# EAGLE design Adafruit AHT20 Temperature & Humidity (EAGLE 9.6.1)
COMPANY: ADAFRUIT INDUSTRIES; DRAWN: KTOWN; REV: A
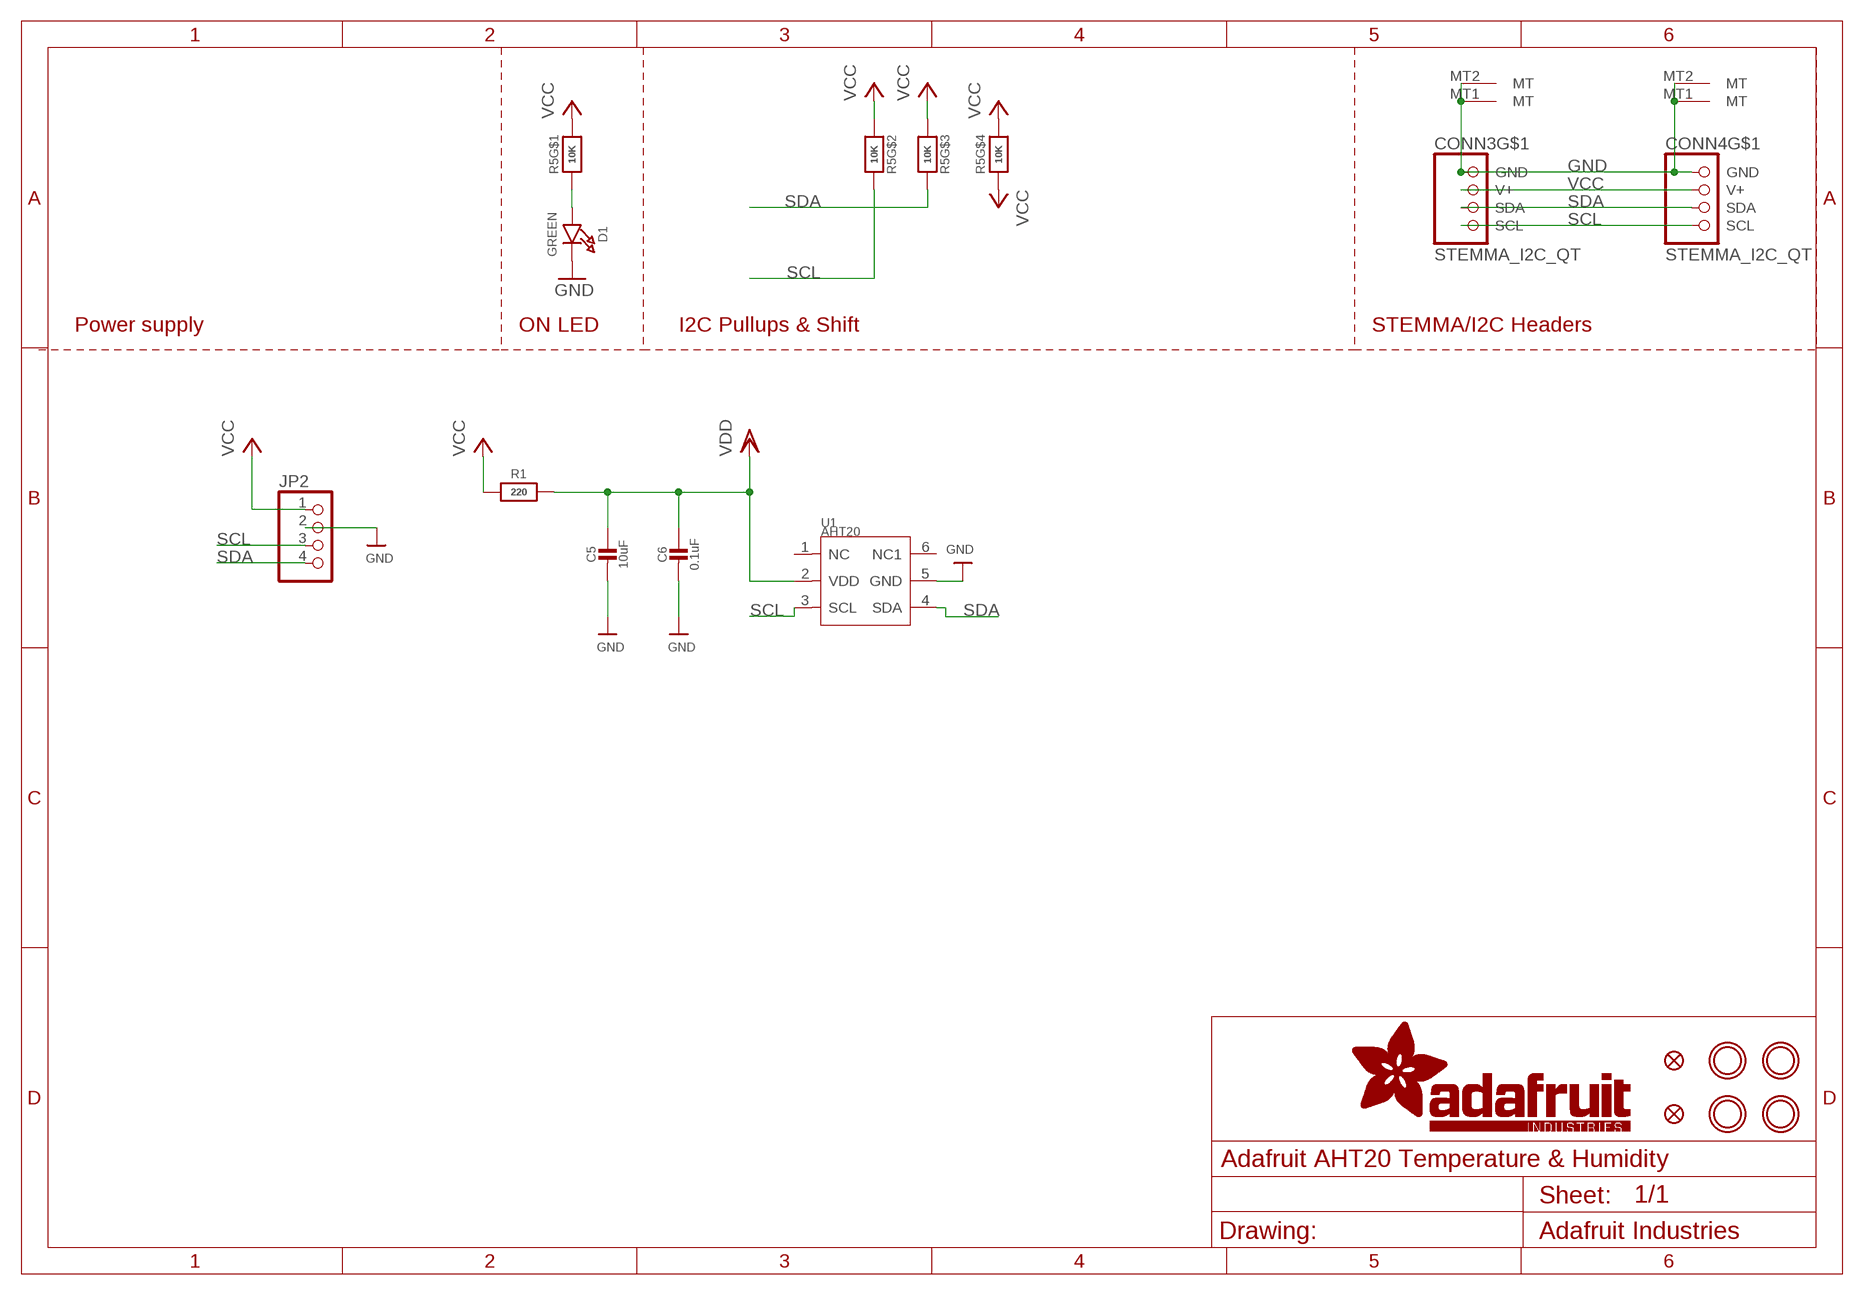
[diagram p0: schematic, sheet 1]

## Parts
C5  10uF  CAP_CERAMIC0805-NOOUTLINE  [0805-NO]
C6  0.1uF  CAP_CERAMIC0603_NO  [0603-NO]
CONN3  STEMMA_I2C_QT  [JST_SH4]
CONN4  STEMMA_I2C_QT  [JST_SH4]
D1  GREEN  LED0603_NOOUTLINE  [CHIPLED_0603_NOOUTLINE]
FID3  FIDUCIAL_1MM  [FIDUCIAL_1MM]
FID4  FIDUCIAL_1MM  [FIDUCIAL_1MM]
JP2  HEADER-1X476MIL  [1X04_ROUND_76]
R1  220  RESISTOR_0603_NOOUT  [0603-NO]
R5  10K  RESISTOR_4PACK  [RESPACK_4X0603]
U1  AHT20  SENSOR-AHT20  [SNR6-1.0-3X3X1MM]
U$19  MOUNTINGHOLE2.5  [MOUNTINGHOLE_2.5_PLATED]
U$20  MOUNTINGHOLE2.5  [MOUNTINGHOLE_2.5_PLATED]
U$22  MOUNTINGHOLE2.5  [MOUNTINGHOLE_2.5_PLATED]
U$25  MOUNTINGHOLE2.5  [MOUNTINGHOLE_2.5_PLATED]

## Nets
GND: C5.2 C6.2 CONN3.1(GND) CONN3.MT1(MT) CONN3.MT2(MT) CONN4.1(GND) CONN4.MT1(MT) CONN4.MT2(MT) D1.C JP2.2 U1.5(GND)
N$1: D1.A R5.1
SCL: CONN3.4(SCL) CONN4.4(SCL) JP2.3 R5.7 U1.3(SCL)
SDA: CONN3.3(SDA) CONN4.3(SDA) JP2.4 R5.6 U1.4(SDA)
VCC [highpower]: CONN3.2(V+) CONN4.2(V+) JP2.1 R1.1 R5.2 R5.3 R5.4 R5.5 R5.8
VDD: C5.1 C6.1 R1.2 U1.2(VDD)
Unconnected: U1.1(NC) U1.6(NC1)

## Notes on the sheet
- Power supply | ON LED | I2C Pullups & Shift | STEMMA/I2C Headers

## Library data of the parts
C5 C6 = microbuilder:CAP_CERAMIC: Ceramic Capacitors For new designs, use the packages preceded by an '_' character since they are more reliable: The following footprints should be used on most boards: _0402 - Standard footprint for regular board layouts _0603 - Standard footprint for regular board layouts _0805 - Standard footprint for regular board layouts _1206 - Standard footprint for regular board layouts For extremely tight-pitch boards where space is at a premium, the following 'micro-pitch' footprints can be used (smaller pads, no silkscreen outline, etc.): _0402MP - Micro-pitch footprint for very dense/compact boards _0603MP - Micro-pitch footprint for very dense/compact boards _0805MP - Micro-pitch footprint for very dense/compact boards _1206MP - Micro-pitch footprint for very dense/compact boards
CONN3 CONN4 = microbuilder:STEMMA_I2C
D1 = microbuilder:LED: LED 0603 - 0603 Surface Mount Package 2mA: Green LED - Low Power (3.9mcd, 2ma, 1.7Vf) - Digikey: 475-2709-2-ND Orange LED - Low Power (9.8mcd, 2ma, 1.8Vf) - Digikey: 475-1194-2-ND Red LED - Low Power (5mcd, 2ma, 1.8Vf) - Digikey: 475-1195-2-ND Yellow LED - Low Power (7mcd, 2ma, 1.8Vf) - Digikey: 475-1196-2-ND 5mA: Blue LED - Low Power (17mcd, 5ma, 2.9Vf) - Digikey: LNJ937W8CRACT-ND 0805 - 0805 Surface Mount Package 2mA: Red LED (8.8mcd, 2mA, 1.8Vf, Clear) - Low Power [Digikey: 475-2510-1-ND] Green LED (5mcd, 2mA, 1.8Vf, Clear) - Low Power [Digikey: 475-2730-1-ND] Yellow LED (11.3mcd, 2mA, 1.8Vf, Clear) - Low Power [Digikey: 475-2555-1-ND] 20mA: Red LED (104mcd, 20mA, Diffused) - LS R976 [Digikey: 475-1278-6-ND] Red LED (12mcd, 20mA, 2.0Vf, Clear) - APT2012EC [Digikey: 754-1128-1-ND] Green LED (15mcd, 20mA, 2.2Vf, Clear) - APT2012GC [Digikey: 754-1131-1-ND] Orange LED (160mcd, 20mA, 2.1Vf, Clear) - APT2012SECK [Digikey: 754-1130-1-ND] 1206 - 1206 Surface Mount Package Green LED (26mcd, 20mA, Diffused) - LG N971 [Digikey: 475-1407-6-ND] Red LED (15mcd, 20mA, Diffused) - LH N974 [Digikey: 475-1416-6-ND] Cree - Cree High-Power Surface Mount LEDs XPEBWT-L1-0000-00D50 - White 111lm 350mA 2.9Vf 6200K 110° XTEAWT-00-0000-00000LEE3 - White 114lm 350mA 2.85Vf 5000K 115° Everlight - Everlight 45-21 Series Surface Mount LEDs 45-21/QK2C-B2832AC2CB2/2T - Warm White 2000mcd 20mA 3.25Vf 3050K 120° 45-21/LK2C-B38452C4CB2/2T - Nuetral White 2000mcd 20mA 3.25Vf 4150K 120° 45-21/LK2C-B50634C6CB2/2T - Cold White 2200mcd 20mA 3.25Vf 5650K 120° PLCC2 Reverse Mount LS T77K-J1L2-1-0-2-R18-Z - Red 11.25mcd 2mA 1.8Vf 630nm 120° LO T77K-L1M2-24-Z - Orange 19.6mcd 2mA 1.8Vf 606nm 120° LY T77K-K2M1-26-Z - Yellow 15.7mcd 2mA 1.8Vf 587nm 120°
FID3 FID4 = microbuilder:FIDUCIAL: Fiducial Alignment Points Various fiducial points for machine vision alignment.; BOM: EXCLUDE
JP2 = microbuilder:HEADER-1X4: PIN HEADER
R1 = microbuilder:RESISTOR: Resistors For new designs, use the packages preceded by an '_' character since they are more reliable: The following footprints should be used on most boards: _0402 - Standard footprint for regular board layouts _0603 - Standard footprint for regular board layouts _0805 - Standard footprint for regular board layouts _1206 - Standard footprint for regular board layouts For extremely tight-pitch boards where space is at a premium, the following 'micro-pitch' footprints can be used (smaller pads, no silkscreen outline, etc.): _0402MP - Micro-pitch footprint for very dense/compact boards _0603MP - Micro-pitch footprint for very dense/compact boards _0805MP - Micro-pitch footprint for very dense/compact boards _1206MP - Micro-pitch footprint for very dense/compact boards
R5 = microbuilder:RESISTOR_4PACK: Resistor Packs (4 resistors) 4 x 0603 10K 1/16W - Digikey: YC164J-10KCT-ND
U1 = Longan-IC:SENSOR-AHT20
U$19 U$20 U$22 U$25 = microbuilder:MOUNTINGHOLE: Mounting Hole For #2 screws (0.086"/2.18mm width, 0.094"/2.4mm hole) use 2.5mm; BOM: EXCLUDE

## Net classes
1 highpower: width 0.305 mm, drill 0.483 mm
2 lowpower: width 0.254 mm, drill 0.483 mm

## Board
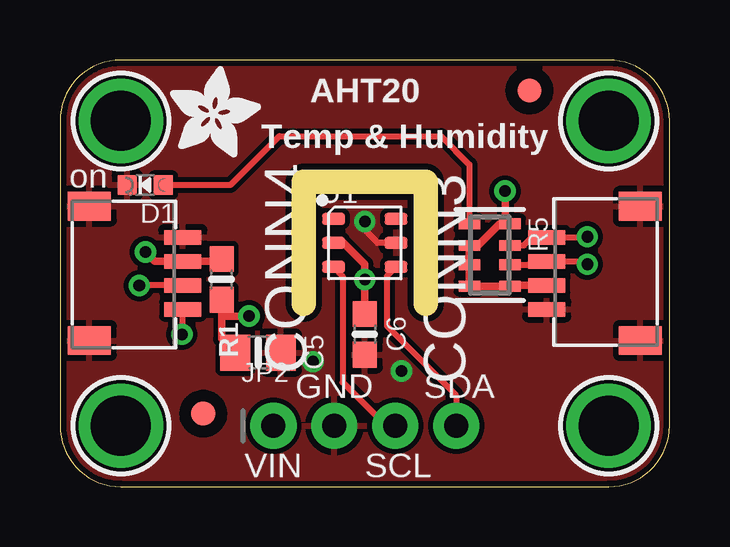
[diagram p1: board, top side]
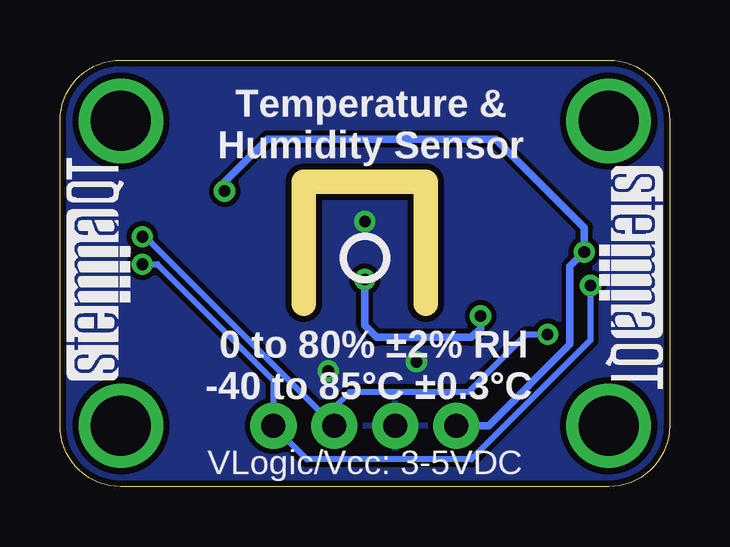
[diagram p2: board, bottom side, seen from below]

Size 25.4 x 17.78 mm. Coordinates in mm from the lower left corner, seen from the top.
Outline: 10.16,7.62 10.16,12.7 15.24,12.7 15.24,7.62
Outline: 0,15.24 0,2.54 arc90 2.54,0 22.86,0 arc90 25.4,2.54 25.4,15.24 arc90 22.86,17.78 2.54,17.78 arc90 0,15.24
Copper layers (1*16): Top 0.035mm / dielectric 1.5mm / Bottom 0.035mm
Design rules "adafruit": minimum track width 8mil, minimum drill 15.5mil, track to track 8mil, track to pad 8mil, pad to pad 8mil, via to via 8mil, smd to smd 8mil, copper to edge 10mil, drill to drill 8mil, minimum pad ring 10mil, minimum via ring 8mil, stop-mask expansion 2mil, vias tented up to drill 20mil, thermal gap 10mil

### Footprints (pad centres in the part's own frame; a part is rotated, then mirrored left to right if it is on the bottom)
0805-NO = smd 1.24 x 1.5: 1 -0.95,0; 2 0.95,0
0603-NO = smd 1.075 x 1: 1 -0.85,0; 2 0.85,0
JST_SH4 = smd 0.6 x 1.55: 1 -1.5,2.514; 2 -0.5,2.514; 3 0.5,2.514; 4 1.5,2.514 | smd 1.2 x 1.8: MT1 -2.8,-1.386; MT2 2.8,-1.386
CHIPLED_0603_NOOUTLINE = smd 0.8 x 0.8: A 0,-0.75; C 0,0.75
FIDUCIAL_1MM = smd 1 x 1: 1 0,0
1X04_ROUND_76 = drill 1 pad 1.93: 1 -3.81,0; 2 -1.27,0; 3 1.27,0; 4 3.81,0
RESPACK_4X0603 = smd 0.45 x 0.9: 1 -1.3,-0.85; 2 -0.4,-0.85; 3 0.4,-0.85; 4 1.3,-0.85; 5 1.3,0.85; 6 0.4,0.85; 7 -0.4,0.85; 8 -1.3,0.85
SNR6-1.0-3X3X1MM = smd 0.95 x 0.5: 1 -1.3,1; 2 -1.3,0; 3 -1.3,-1; 4 1.3,-1; 5 1.3,0; 6 1.3,1
MOUNTINGHOLE_2.5_PLATED = drill 2.5 pad 3.2: P$1 0,0

### Placement (x,y rotation side)
C5  8.26,5.59 0 top
C6  12.7,6.35 270 top
CONN3  22.8,8.89 90 top
CONN4  2.6,8.89 270 top
D1  3.56,12.57 90 top
FID3  5.97,3.05 0 top
FID4  19.56,16.51 0 top
JP2  12.7,2.54 0 top
R1  6.73,8.64 270 top
R5  17.91,9.65 270 top
U1  12.7,10.16 0 top
U$19  2.54,15.24 0 top
U$20  22.86,15.24 0 top
U$22  2.54,2.54 0 top
U$25  22.86,2.54 0 top
U$28  [ADAFRUIT_3.5MM]  4.57,13.72 0 top
U$29  [PCBFEAT-REV-040]  12.7,9.53 0 bottom
U$30  [STEMMAQT]  22.48,4.45 90 bottom
U$31  [STEMMAQT]  2.92,13.34 270 bottom

### Tracks (layer width: path | path; a pad name or v marks a point on that pad's centre or on a via)
GND  (via drill 0.48)
  Top 0.254: U1.5 13.24,10.16 12.7,10.7 v12.7,11.05
  other vias: 14.22,4.83 10.54,5.21
  pour Top: 0,17.78 25.4,17.78 25.4,0 0,0
  pour Bottom: 0,17.78 25.4,17.78 25.4,0 0,0
N$1
  Top 0.254: D1.A 7.11,12.57 9.14,14.61 15.88,14.61 17.06,13.42 R5.1
SCL  (via drill 0.48)
  Top 0.254: JP2.3 13.59,2.54 11.78,4.35 11.78,8.78 U1.3 | R5.7 19.32,10.05 19.66,10.39 CONN3.4 21.95,10.39 v21.97,10.41 | CONN4.4 5.1,7.38 5.1,6.37 v5.08,6.35
  Bottom 0.254: v21.97,10.41 21.84,10.41 JP2.3 13.97,3.3 13.34,3.94 8.38,3.94 5.97,6.35 v5.08,6.35
SDA  (via drill 0.48)
  Top 0.254: U1.4 13.62,8.78 13.62,6.7 16.51,3.81 JP2.4 | R5.6 19.54,9.25 19.68,9.4 CONN3.3 21.85,9.39 v21.97,9.27 | CONN4.3 v3.31,8.39 v3.3,8.38
  Bottom 0.254: v21.97,9.27 21.35,9.27 16.51,4.43 JP2.4 15.11,1.14 8.26,1.14 3.3,6.1 v3.3,8.38
VCC  (via drill 0.48)
  Top 0.305: CONN3.2 18.8,8.39 R5.5 R5.4 R5.3 R5.2 17.42,10.05 18.32,10.95 18.54,10.95 | R5.8 18.54,10.95 | R1.1 6.63,9.39 CONN4.2 3.94,9.39 v3.56,9.78 | v18.54,12.32 18.54,10.95
  Bottom 0.305: JP2.1 7.54,2.54 4.15,5.93 4.15,9.18 v3.56,9.78 3.56,10.79 7.24,14.48 16.76,14.48 18.54,12.7 v18.54,12.32
VDD  (via drill 0.48)
  Top 0.305: C5.1 6.73,6.16 R1.2 6.73,7.11 v7.87,7.11 | C6.1 v12.7,8.64 12.7,9.27 11.81,10.16 U1.2
  Bottom 0.305: v7.87,7.11 7.87,6.6 8.26,6.22 12.19,6.22 12.7,6.73 v12.7,8.64

### Text on the board
tPlace: AHT20 | Temp & Humidity | on | GND | SDA | VIN | SCL
bPlace: Temperature & / Humidity Sensor | 0 to 80% ±2% RH / -40 to 85°C ±0.3°C | VLogic/Vcc: 3-5VDC